# EasyEDA Pro project coildriver.eprj, schematic Schematic1
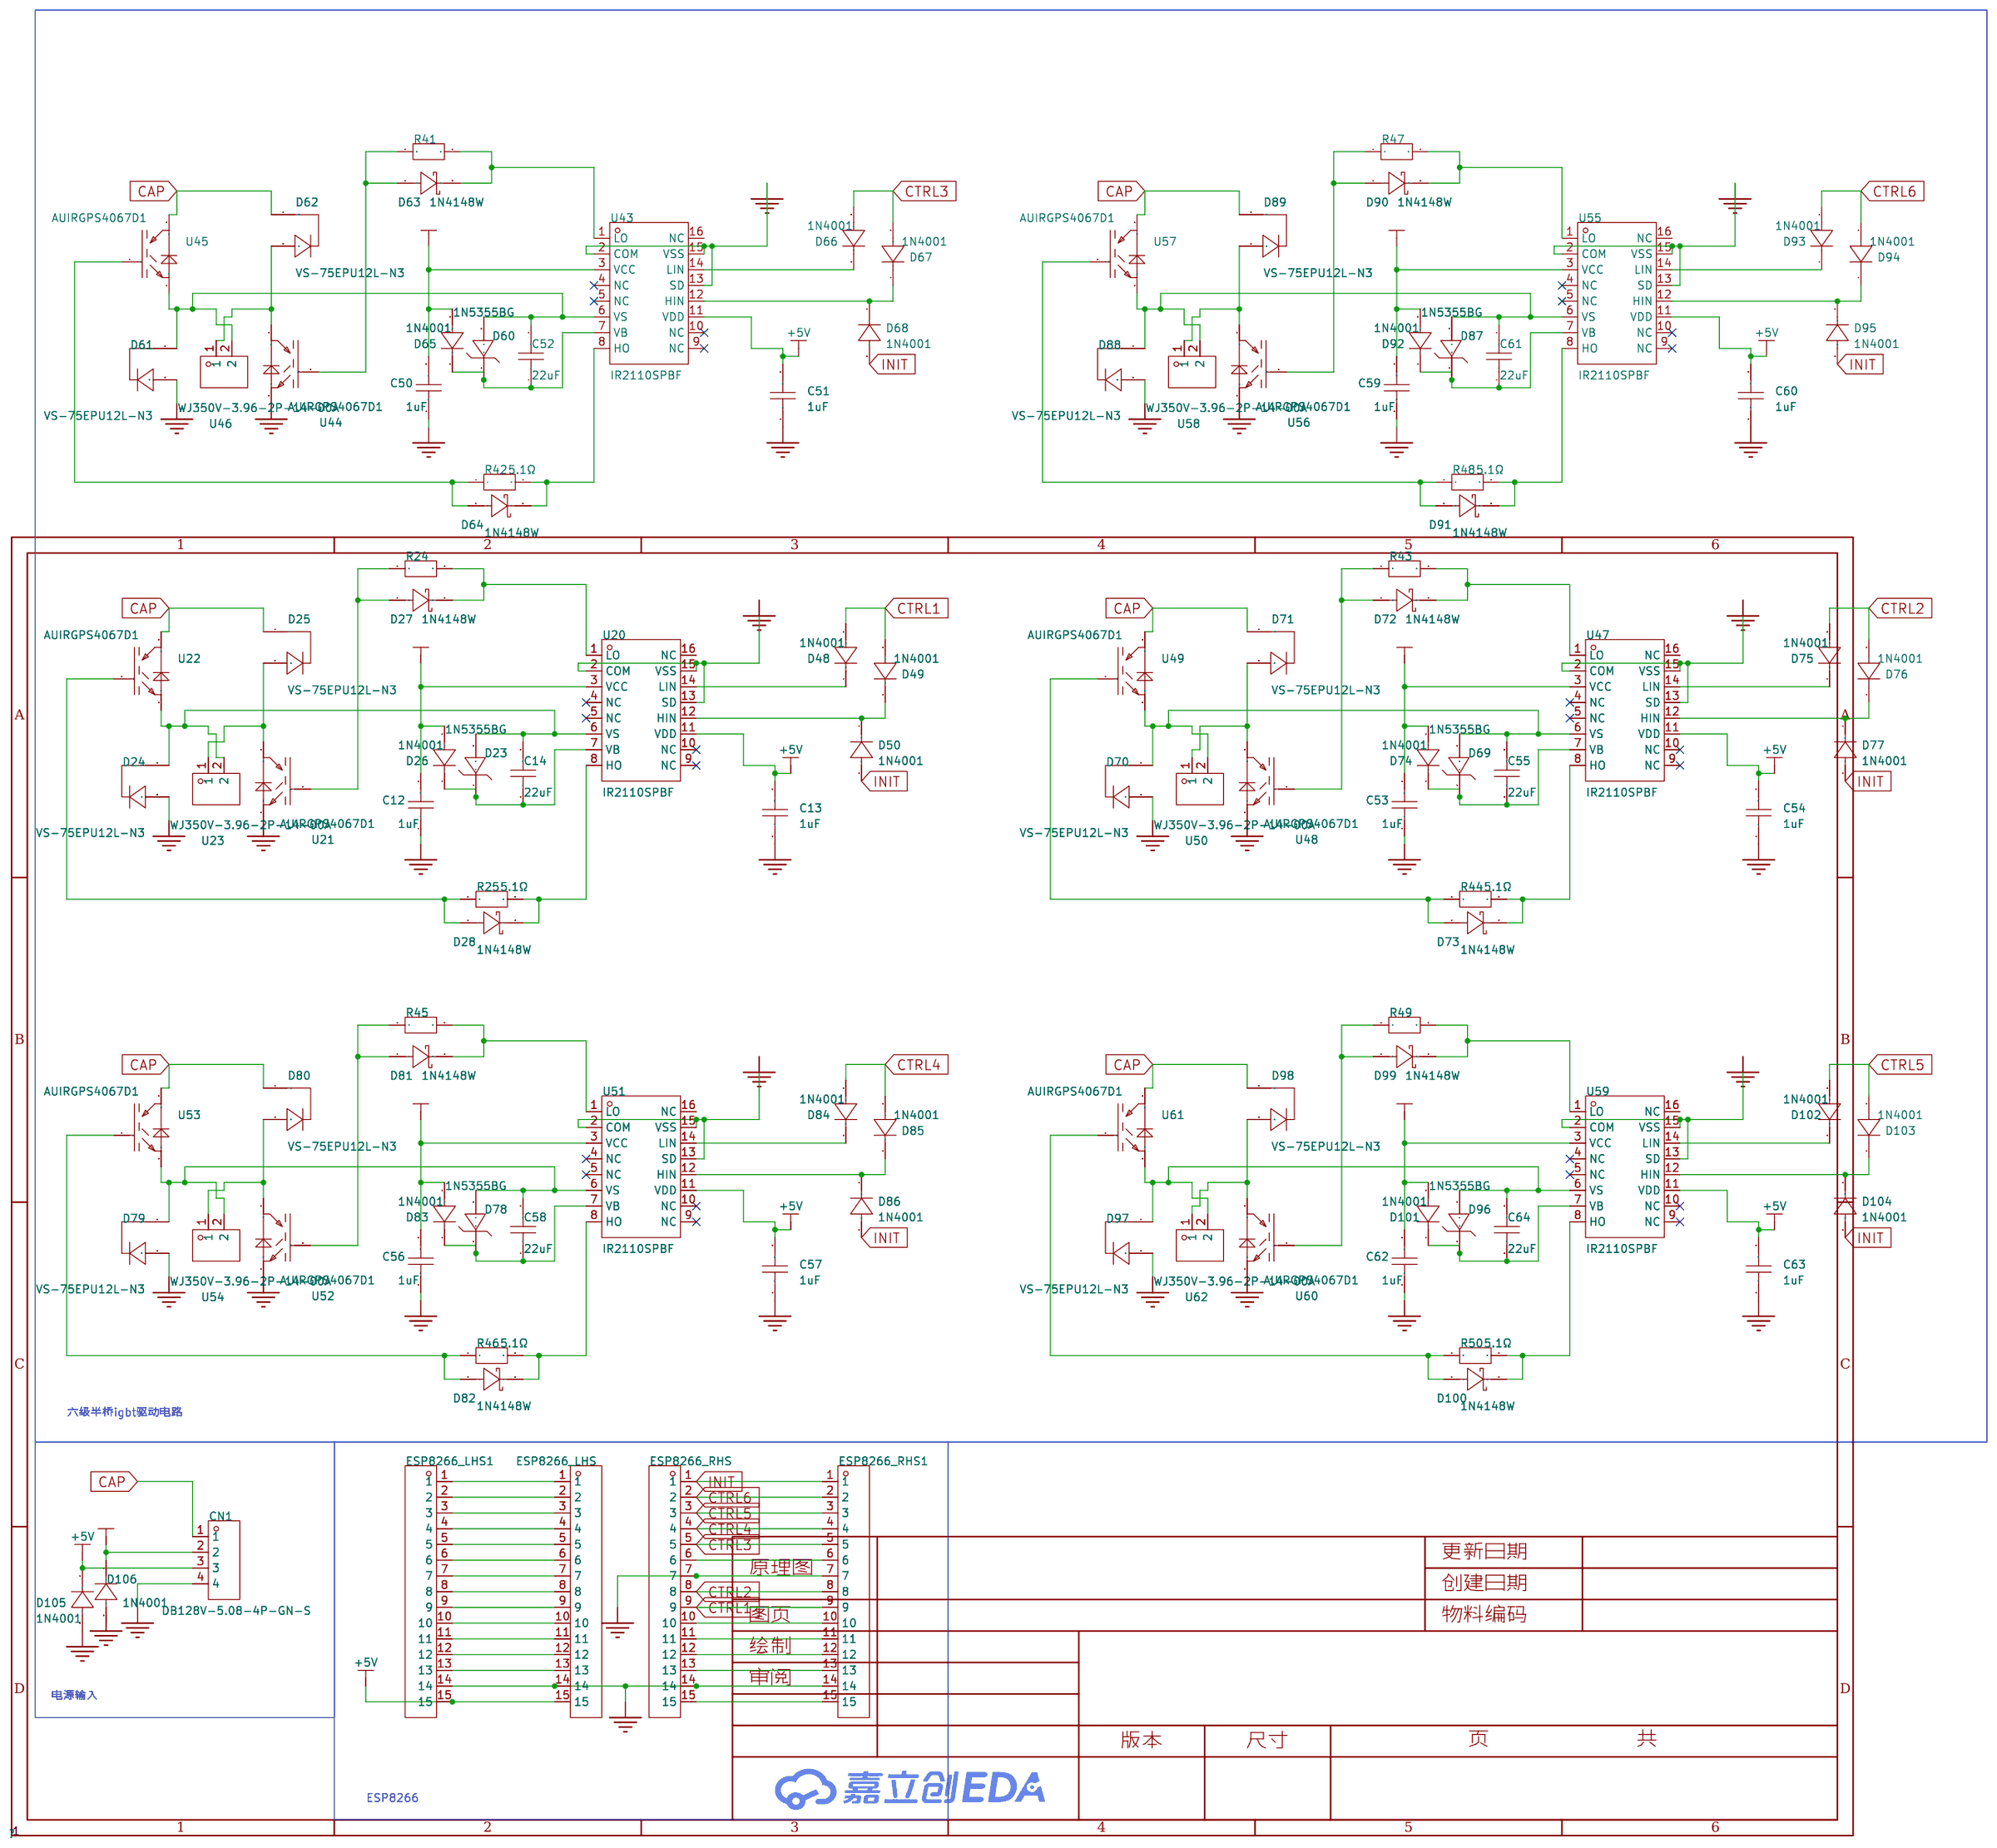
[diagram p0: schematic sheet]

## Parts
C12  1uF  [C0603]
C13  1uF  [C0603]
C14  22uF  [C0603]
C50  1uF  [C0603]
C51  1uF  [C0603]
C52  22uF  [C0603]
C53  1uF  [C0603]
C54  1uF  [C0603]
C55  22uF  [C0603]
C56  1uF  [C0603]
C57  1uF  [C0603]
C58  22uF  [C0603]
C59  1uF  [C0603]
C60  1uF  [C0603]
C61  22uF  [C0603]
C62  1uF  [C0603]
C63  1uF  [C0603]
C64  22uF  [C0603]
CN1  DB128V-5.08-4P-GN-S  [CONN-TH_4P-P5.08_DIBO_DB128V-5.08]
D23  1N5355BG  [DO-201_BD5.3-L9.5-P13.50-D1.4-RD]
D24  VS-75EPU12L-N3  [TO-247-2_L15.8-W5.0-P10.92-L]
D25  VS-75EPU12L-N3  [TO-247-2_L15.8-W5.0-P10.92-L]
D26  1N4001  [SMA_L4.3-W2.5-LS5.0-RD]
D27  1N4148W  [SOD-123_L2.7-W1.6-LS3.7-FD]
D28  1N4148W  [SOD-123_L2.7-W1.6-LS3.7-FD]
D48  1N4001  [SMA_L4.3-W2.5-LS5.0-RD]
D49  1N4001  [SMA_L4.3-W2.5-LS5.0-RD]
D50  1N4001  [SMA_L4.3-W2.5-LS5.0-RD]
D60  1N5355BG  [DO-201_BD5.3-L9.5-P13.50-D1.4-RD]
D61  VS-75EPU12L-N3  [TO-247-2_L15.8-W5.0-P10.92-L]
D62  VS-75EPU12L-N3  [TO-247-2_L15.8-W5.0-P10.92-L]
D63  1N4148W  [SOD-123_L2.7-W1.6-LS3.7-FD]
D64  1N4148W  [SOD-123_L2.7-W1.6-LS3.7-FD]
D65  1N4001  [SMA_L4.3-W2.5-LS5.0-RD]
D66  1N4001  [SMA_L4.3-W2.5-LS5.0-RD]
D67  1N4001  [SMA_L4.3-W2.5-LS5.0-RD]
D68  1N4001  [SMA_L4.3-W2.5-LS5.0-RD]
D69  1N5355BG  [DO-201_BD5.3-L9.5-P13.50-D1.4-RD]
D70  VS-75EPU12L-N3  [TO-247-2_L15.8-W5.0-P10.92-L]
D71  VS-75EPU12L-N3  [TO-247-2_L15.8-W5.0-P10.92-L]
D72  1N4148W  [SOD-123_L2.7-W1.6-LS3.7-FD]
D73  1N4148W  [SOD-123_L2.7-W1.6-LS3.7-FD]
D74  1N4001  [SMA_L4.3-W2.5-LS5.0-RD]
D75  1N4001  [SMA_L4.3-W2.5-LS5.0-RD]
D76  1N4001  [SMA_L4.3-W2.5-LS5.0-RD]
D77  1N4001  [SMA_L4.3-W2.5-LS5.0-RD]
D78  1N5355BG  [DO-201_BD5.3-L9.5-P13.50-D1.4-RD]
D79  VS-75EPU12L-N3  [TO-247-2_L15.8-W5.0-P10.92-L]
D80  VS-75EPU12L-N3  [TO-247-2_L15.8-W5.0-P10.92-L]
D81  1N4148W  [SOD-123_L2.7-W1.6-LS3.7-FD]
D82  1N4148W  [SOD-123_L2.7-W1.6-LS3.7-FD]
D83  1N4001  [SMA_L4.3-W2.5-LS5.0-RD]
D84  1N4001  [SMA_L4.3-W2.5-LS5.0-RD]
D85  1N4001  [SMA_L4.3-W2.5-LS5.0-RD]
D86  1N4001  [SMA_L4.3-W2.5-LS5.0-RD]
D87  1N5355BG  [DO-201_BD5.3-L9.5-P13.50-D1.4-RD]
D88  VS-75EPU12L-N3  [TO-247-2_L15.8-W5.0-P10.92-L]
D89  VS-75EPU12L-N3  [TO-247-2_L15.8-W5.0-P10.92-L]
D90  1N4148W  [SOD-123_L2.7-W1.6-LS3.7-FD]
D91  1N4148W  [SOD-123_L2.7-W1.6-LS3.7-FD]
D92  1N4001  [SMA_L4.3-W2.5-LS5.0-RD]
D93  1N4001  [SMA_L4.3-W2.5-LS5.0-RD]
D94  1N4001  [SMA_L4.3-W2.5-LS5.0-RD]
D95  1N4001  [SMA_L4.3-W2.5-LS5.0-RD]
D96  1N5355BG  [DO-201_BD5.3-L9.5-P13.50-D1.4-RD]
D97  VS-75EPU12L-N3  [TO-247-2_L15.8-W5.0-P10.92-L]
D98  VS-75EPU12L-N3  [TO-247-2_L15.8-W5.0-P10.92-L]
D99  1N4148W  [SOD-123_L2.7-W1.6-LS3.7-FD]
D100  1N4148W  [SOD-123_L2.7-W1.6-LS3.7-FD]
D101  1N4001  [SMA_L4.3-W2.5-LS5.0-RD]
D102  1N4001  [SMA_L4.3-W2.5-LS5.0-RD]
D103  1N4001  [SMA_L4.3-W2.5-LS5.0-RD]
D104  1N4001  [SMA_L4.3-W2.5-LS5.0-RD]
D105  1N4001  [SMA_L4.3-W2.5-LS5.0-RD]
D106  1N4001  [SMA_L4.3-W2.5-LS5.0-RD]
ESP8266_LHS  KH-2.54FH-1X15P-H8.5  [HDR-TH_15P-P2.54-V-F]
ESP8266_LHS1  KH-2.54FH-1X15P-H8.5  [HDR-TH_15P-P2.54-V-F]
ESP8266_RHS  KH-2.54FH-1X15P-H8.5  [HDR-TH_15P-P2.54-V-F]
ESP8266_RHS1  KH-2.54FH-1X15P-H8.5  [HDR-TH_15P-P2.54-V-F]
R24  5.1Ω  [R1206]
R25  5.1Ω  [R1206]
R41  5.1Ω  [R1206]
R42  5.1Ω  [R1206]
R43  5.1Ω  [R1206]
R44  5.1Ω  [R1206]
R45  5.1Ω  [R1206]
R46  5.1Ω  [R1206]
R47  5.1Ω  [R1206]
R48  5.1Ω  [R1206]
R49  5.1Ω  [R1206]
R50  5.1Ω  [R1206]
U20  IR2110SPBF  [SOIC-16_L10.3-W7.5-P1.27-LS10.3-BL]
U21  AUIRGPS4067D1  [SUPER-247_L15.6-W5.0-P5.45-L]
U22  AUIRGPS4067D1  [SUPER-247_L15.6-W5.0-P5.45-L]
U23  WJ350V-3.96-2P-14-00A  [CONN-TH_2P-P3.96_WJ350V-3.96-2P-14-00A]
U43  IR2110SPBF  [SOIC-16_L10.3-W7.5-P1.27-LS10.3-BL]
U44  AUIRGPS4067D1  [SUPER-247_L15.6-W5.0-P5.45-L]
U45  AUIRGPS4067D1  [SUPER-247_L15.6-W5.0-P5.45-L]
U46  WJ350V-3.96-2P-14-00A  [CONN-TH_2P-P3.96_WJ350V-3.96-2P-14-00A]
U47  IR2110SPBF  [SOIC-16_L10.3-W7.5-P1.27-LS10.3-BL]
U48  AUIRGPS4067D1  [SUPER-247_L15.6-W5.0-P5.45-L]
U49  AUIRGPS4067D1  [SUPER-247_L15.6-W5.0-P5.45-L]
U50  WJ350V-3.96-2P-14-00A  [CONN-TH_2P-P3.96_WJ350V-3.96-2P-14-00A]
U51  IR2110SPBF  [SOIC-16_L10.3-W7.5-P1.27-LS10.3-BL]
U52  AUIRGPS4067D1  [SUPER-247_L15.6-W5.0-P5.45-L]
U53  AUIRGPS4067D1  [SUPER-247_L15.6-W5.0-P5.45-L]
U54  WJ350V-3.96-2P-14-00A  [CONN-TH_2P-P3.96_WJ350V-3.96-2P-14-00A]
U55  IR2110SPBF  [SOIC-16_L10.3-W7.5-P1.27-LS10.3-BL]
U56  AUIRGPS4067D1  [SUPER-247_L15.6-W5.0-P5.45-L]
U57  AUIRGPS4067D1  [SUPER-247_L15.6-W5.0-P5.45-L]
U58  WJ350V-3.96-2P-14-00A  [CONN-TH_2P-P3.96_WJ350V-3.96-2P-14-00A]
U59  IR2110SPBF  [SOIC-16_L10.3-W7.5-P1.27-LS10.3-BL]
U60  AUIRGPS4067D1  [SUPER-247_L15.6-W5.0-P5.45-L]
U61  AUIRGPS4067D1  [SUPER-247_L15.6-W5.0-P5.45-L]
U62  WJ350V-3.96-2P-14-00A  [CONN-TH_2P-P3.96_WJ350V-3.96-2P-14-00A]

## Library data of the parts
C12 C13 C50 C51 C53 C54 C56 C57 C59 C60 C62 C63 = CL10A105KB8NNNC: LCSC Part Name: 1uF ±10% 50V; Supplier Part: C15849; Manufacturer: SAMSUNG(三星); Supplier Footprint: 0603; JLCPCB Part Class: Basic Part; Datasheet: https://atta.szlcsc.com/upload/public/pdf/source/20160218/1457707763339.pdf; Supplier: LCSC; Tolerance: ±10%; Voltage Rated: 50V; Temperature Coefficient: X5R
C14 C52 C55 C58 C61 C64 = CL10A226MQ8NRNC: LCSC Part Name: 22uF ±20% 6.3V; Supplier Part: C59461; Manufacturer: SAMSUNG(三星); Supplier Footprint: 0603; JLCPCB Part Class: Basic Part; Datasheet: https://atta.szlcsc.com/upload/public/pdf/source/20160218/1457707763339.pdf; Supplier: LCSC; Tolerance: ±20%; Voltage Rated: 6.3V; Temperature Coefficient: X5R
CN1 = DB128V-5.08-4P-GN-S: LCSC Part Name: 5.08mm 1x4P 排数:1 每排P数:4 直插; Supplier Part: C2915641; Manufacturer: DORABO(地博电气); Supplier Footprint: 插件,P=5.08mm; JLCPCB Part Class: 扩展库; Datasheet: https://atta.szlcsc.com/upload/public/pdf/source/20230106/CC449C10514519CDCE20F1C37DBF2DAC.pdf; Supplier: LCSC; Structure: 1x4P; Pitch: 5.08mm; Color: 绿色; Mounting Style: 直插; Current Rating (Max): 20A; Voltage Rating (Max): 300V; Number of Pins: 4P; Number of Rows: 1; Wire Gauge - AWG: 12~30; Wire Gauge - mm2: 2.5; Number of PINs Per Row: 4; Operating Temperature Range: -40℃~+105℃
D23 D60 D69 D78 D87 D96 = 1N5355BG: Supplier Part: C232448; Manufacturer: onsemi(安森美); Supplier Footprint: DO-201; JLCPCB Part Class: 扩展库; Datasheet: https://atta.szlcsc.com/upload/public/pdf/source/20221020/A8BE51F363EA53205BAD311FF4A36ACF.pdf; Supplier: LCSC; Diode Configuration: 独立式; Zener Voltage (Nom): 18V; Reverse Leakage Current (Ir): 500nA@13.7V; Zener Voltage (Range): 17.1V~18.9V; Power Dissipation: 5W; Zener Impedance (Zzt): 2.5Ω; Tolerance: ±5%
D24 D25 D61 D62 D70 D71 D79 D80 D88 D89 D97 D98 = VS-75EPU12L-N3: LCSC Part Name: 电压:1.2kV 电流:75A; Supplier Part: C335787; Manufacturer: VISHAY(威世); Supplier Footprint: TO-247-2; JLCPCB Part Class: 扩展库; Datasheet: https://atta.szlcsc.com/upload/public/pdf/source/20181127/C335787_ECD477527F5F67B2867CBD5AAE4D0851.pdf; Supplier: LCSC; Diode Configuration: 独立式; Forward Voltage (Vf@If): 2.05V@75A; Reverse Voltage (Vr): 1.2kV; Average Rectified Current (Io): 75A; Reverse Leakage Current: 420uA@1.2kV
D26 D48-D50 D65-D68 D74-D77 D83-D86 D92-D95 D101-D106 = 1N4001_C727079: LCSC Part Name: 电压:50V 电流:1A; Supplier Part: C727079; Manufacturer: TWGMC(台湾迪嘉); Supplier Footprint: SMA(DO-214AC); JLCPCB Part Class: 扩展库; Datasheet: https://atta.szlcsc.com/upload/public/pdf/source/20200828/C727079_3A05254382567072883400655AE0ED46.pdf; Supplier: LCSC; Diode Configuration: 独立式; Forward Voltage (Vf@If): 1.1V@1A; Reverse Voltage (Vr): 50V; Average Rectified Current (Io): 1A; Reverse Leakage Current: 5uA@50V
D27 D28 D63 D64 D72 D73 D81 D82 D90 D91 D99 D100 = 1N4148W_C7420318: LCSC Part Name: 电压:100V 电流:150mA; Supplier Part: C7420318; Manufacturer: 宏迦橙; Supplier Footprint: SOD-123; JLCPCB Part Class: 扩展库; Datasheet: https://atta.szlcsc.com/upload/public/pdf/source/20230828/E5C3F7A4272052930A7E03B75759BF50.pdf; Supplier: LCSC; Diode Configuration: 独立式; Forward Voltage (Vf@If): 1.25V@150mA; Reverse Voltage (Vr): 100V; Average Rectified Current (Io): 150mA; Power Dissipation: 400mW; Reverse Leakage Current: 1uA@75V; Reverse Recovery Time (trr): 4ns; Operating Temperature: -55℃~+150℃
ESP8266_LHS ESP8266_LHS1 ESP8266_RHS ESP8266_RHS1 = KH-2.54FH-1X15P-H8.5: LCSC Part Name: 间距:2.54mm 1x15P 直插; Supplier Part: C2932676; Manufacturer: kinghelm(金航标); Supplier Footprint: 插件,P=2.54mm; JLCPCB Part Class: 扩展库; Datasheet: https://atta.szlcsc.com/upload/public/pdf/source/20211220/977AA415CFA981E866620A80068F25CA.pdf; Supplier: LCSC; Holes Structure: 1x15P; Pitch: 2.54mm; Circular Hole / Square Hole: 方孔; Mounting Type: 直插; Number of Rows: 单排; Number of Holes: 15P; Current Rating (Max): 3A; Holes Direction: 顶部; Insulation Height: 8.5mm; Operating Temperature Range: -40℃~+105℃
R24 R25 R41-R50 = FRC1206F5R10TS: LCSC Part Name: 5.1Ω ±1% 250mW 厚膜电阻; Supplier Part: C2933736; Manufacturer: FOJAN(富捷); Supplier Footprint: 1206; JLCPCB Part Class: 扩展库; Datasheet: https://atta.szlcsc.com/upload/public/pdf/source/20211221/925EC7D7225764EE0046F22065062C87.pdf; Supplier: LCSC; Type: 厚膜电阻; Tolerance: ±1%; Power(Watts): 250mW; Overload Voltage (Max): 200V; Temperature Coefficient: ±200ppm/℃; Operating Temperature Range: -55℃~+155℃
U20 U43 U47 U51 U55 U59 = IR2110SPBF: Supplier Part: C537554; Manufacturer: Infineon(英飞凌); Supplier Footprint: SOIC-16-300mil; JLCPCB Part Class: 扩展库; Datasheet: https://atta.szlcsc.com/upload/public/pdf/source/20200525/C537554_DAB217F314E1627DF0DDC7BBE3BE6BA1.pdf; Supplier: LCSC; Driven Configuration: 半桥; Load Type: MOSFET；IGBT; Number of Drivers: 2; Peak Output Current(sink): 2A; Peak Output Current(source): 2A; Supply Voltage: 3.3V~20V; Rise Time: 25ns; Fall Time: 17ns; Operating Temperature: -40℃~+150℃@(Tj)
U21 U22 U44 U45 U48 U49 U52 U53 U56 U57 U60 U61 = AUIRGPS4067D1: Supplier Part: C9900044144; Supplier Footprint: Super-247; Supplier: LCSC
U23 U46 U50 U54 U58 U62 = WJ350V-3.96-2P-14-00A: LCSC Part Name: 接线端子 直插式/3.96mm 2P 绿色 绿色; Supplier Part: C3031444; Manufacturer: KANGNEX(康奈克斯电气); Supplier Footprint: P=3.96mm; JLCPCB Part Class: 扩展库; Datasheet: https://atta.szlcsc.com/upload/public/pdf/source/20220629/BAC37F157A480165C1624CF249DBB00A.pdf; Supplier: LCSC

## Nets
12V: C12.2 C50.2 C53.2 C56.2 C59.2 C62.2 CN1.2 D26.2(A) D65.2(A) D74.2(A) D83.2(A) D92.2(A) D101.2(A) D106.1(K) U20.3(VCC) U43.3(VCC) U47.3(VCC) U51.3(VCC) U55.3(VCC) U59.3(VCC)
+5V: C13.2 C51.2 C54.2 C57.2 C60.2 C63.2 CN1.3 D105.1(K) ESP8266_LHS.15 ESP8266_LHS1.15 U20.11(VDD) U43.11(VDD) U47.11(VDD) U51.11(VDD) U55.11(VDD) U59.11(VDD)
GND: C12.1 C13.1 C50.1 C51.1 C53.1 C54.1 C56.1 C57.1 C59.1 C60.1 C62.1 C63.1 CN1.4 D24.3 D61.3 D70.3 D79.3 D88.3 D97.3 D105.2(A) D106.2(A) ESP8266_LHS.14 ESP8266_LHS1.14 ESP8266_RHS.7 ESP8266_RHS.14 ESP8266_RHS1.7 ESP8266_RHS1.14 U20.2(COM) U20.13(SD) U20.15(VSS) U21.3(E) U43.2(COM) U43.13(SD) U43.15(VSS) U44.3(E) U47.2(COM) U47.13(SD) U47.15(VSS) U48.3(E) U51.2(COM) U51.13(SD) U51.15(VSS) U52.3(E) U55.2(COM) U55.13(SD) U55.15(VSS) U56.3(E) U59.2(COM) U59.13(SD) U59.15(VSS) U60.3(E)
CAP: CN1.1 D25.1 D62.1 D71.1 D80.1 D89.1 D98.1 U22.2(C) U45.2(C) U49.2(C) U53.2(C) U57.2(C) U61.2(C)
CTRL1: D48.2(A) D49.2(A) ESP8266_RHS.9 ESP8266_RHS1.9
CTRL2: D75.2(A) D76.2(A) ESP8266_RHS.8 ESP8266_RHS1.8
CTRL3: D66.2(A) D67.2(A) ESP8266_RHS.5 ESP8266_RHS1.5
CTRL4: D84.2(A) D85.2(A) ESP8266_RHS.4 ESP8266_RHS1.4
CTRL5: D102.2(A) D103.2(A) ESP8266_RHS.3 ESP8266_RHS1.3
CTRL6: D93.2(A) D94.2(A) ESP8266_RHS.2 ESP8266_RHS1.2
INIT: D50.2(A) D68.2(A) D77.2(A) D86.2(A) D95.2(A) D104.2(A) ESP8266_RHS.1 ESP8266_RHS1.1
$1N13206: D25.3 U21.2(C) U23.1
$1N13207: D48.1(K) U20.14(LIN)
$1N13208: D49.1(K) D50.1(K) U20.12(HIN)
$1N13209: D28.2(K) R25.2 U20.8(HO)
$1N13210: D28.1(A) R25.1 U22.1(G)
$1N13211: D27.2(K) R24.2 U20.1(LO)
$1N13212: D27.1(A) R24.1 U21.1(G)
$1N30415: C14.2 D23.2(A) D24.1 U20.6(VS) U22.3(E) U23.2
$1N30437: C14.1 D23.1(K) D26.1(K) U20.7(VB)
$1N32363: D64.2(K) R42.2 U43.8(HO)
$1N32364: C52.1 D60.1(K) D65.1(K) U43.7(VB)
$1N32374: C52.2 D60.2(A) D61.1 U43.6(VS) U45.3(E) U46.2
$1N32395: D66.1(K) U43.14(LIN)
$1N32396: D67.1(K) D68.1(K) U43.12(HIN)
$1N32406: D63.2(K) R41.2 U43.1(LO)
$1N32408: D63.1(A) R41.1 U44.1(G)
$1N32409: D62.3 U44.2(C) U46.1
$1N32412: D64.1(A) R42.1 U45.1(G)
$1N33221: D73.2(K) R44.2 U47.8(HO)
$1N33222: C55.1 D69.1(K) D74.1(K) U47.7(VB)
$1N33232: C55.2 D69.2(A) D70.1 U47.6(VS) U49.3(E) U50.2
$1N33253: D75.1(K) U47.14(LIN)
$1N33254: D76.1(K) D77.1(K) U47.12(HIN)
$1N33264: D72.2(K) R43.2 U47.1(LO)
$1N33266: D72.1(A) R43.1 U48.1(G)
$1N33267: D71.3 U48.2(C) U50.1
$1N33270: D73.1(A) R44.1 U49.1(G)
$1N36530: D80.3 U52.2(C) U54.1
$1N36531: D84.1(K) U51.14(LIN)
$1N36532: D85.1(K) D86.1(K) U51.12(HIN)
$1N36535: D82.2(K) R46.2 U51.8(HO)
$1N36536: D82.1(A) R46.1 U53.1(G)
$1N36537: D81.2(K) R45.2 U51.1(LO)
$1N36538: D81.1(A) R45.1 U52.1(G)
$1N36559: C58.1 D78.1(K) D83.1(K) U51.7(VB)
$1N36580: D89.3 U56.2(C) U58.1
$1N36581: D93.1(K) U55.14(LIN)
$1N36582: D94.1(K) D95.1(K) U55.12(HIN)
$1N36585: D91.2(K) R48.2 U55.8(HO)
$1N36586: D91.1(A) R48.1 U57.1(G)
$1N36587: D90.2(K) R47.2 U55.1(LO)
$1N36588: D90.1(A) R47.1 U56.1(G)
$1N36595: C61.2 D87.2(A) D88.1 U55.6(VS) U57.3(E) U58.2
$1N36609: C61.1 D87.1(K) D92.1(K) U55.7(VB)
$1N36630: D98.3 U60.2(C) U62.1
$1N36631: D102.1(K) U59.14(LIN)
$1N36632: D103.1(K) D104.1(K) U59.12(HIN)
$1N36635: D100.2(K) R50.2 U59.8(HO)
$1N36636: D100.1(A) R50.1 U61.1(G)
$1N36637: D99.2(K) R49.2 U59.1(LO)
$1N36638: D99.1(A) R49.1 U60.1(G)
$1N36645: C64.2 D96.2(A) D97.1 U59.6(VS) U61.3(E) U62.2
$1N36659: C64.1 D96.1(K) D101.1(K) U59.7(VB)
$1N37726: ESP8266_RHS.6 ESP8266_RHS1.6
$1N37760: ESP8266_RHS.10 ESP8266_RHS1.10
$1N37765: ESP8266_RHS.11 ESP8266_RHS1.11
$1N37770: ESP8266_RHS.12 ESP8266_RHS1.12
$1N37775: ESP8266_RHS.13 ESP8266_RHS1.13
$1N37785: ESP8266_RHS.15 ESP8266_RHS1.15
$1N37872: ESP8266_LHS.1 ESP8266_LHS1.1
$1N37876: ESP8266_LHS.2 ESP8266_LHS1.2
$1N37881: ESP8266_LHS.3 ESP8266_LHS1.3
$1N37886: ESP8266_LHS.4 ESP8266_LHS1.4
$1N37891: ESP8266_LHS.5 ESP8266_LHS1.5
$1N37903: ESP8266_LHS.6 ESP8266_LHS1.6
$1N37907: ESP8266_LHS.7 ESP8266_LHS1.7
$1N37912: ESP8266_LHS.8 ESP8266_LHS1.8
$1N37917: ESP8266_LHS.9 ESP8266_LHS1.9
$1N37922: ESP8266_LHS.10 ESP8266_LHS1.10
$1N37927: ESP8266_LHS.11 ESP8266_LHS1.11
$1N37932: ESP8266_LHS.12 ESP8266_LHS1.12
$1N37937: ESP8266_LHS.13 ESP8266_LHS1.13
$1N38352: C58.2 D78.2(A) D79.1 U51.6(VS) U53.3(E) U54.2

Not connected (* = marked no-connect by the designer): U20 4(NC)* 5(NC)* 9(NC)* 10(NC)* 16(NC); U43 4(NC)* 5(NC)* 9(NC)* 10(NC)* 16(NC); U47 4(NC)* 5(NC)* 9(NC)* 10(NC)* 16(NC); U51 4(NC)* 5(NC)* 9(NC)* 10(NC)* 16(NC); U55 4(NC)* 5(NC)* 9(NC)* 10(NC)* 16(NC); U59 4(NC)* 5(NC)* 9(NC)* 10(NC)* 16(NC)

## Notes on the sheet
- 六级半桥igbt驱动电路
- 电源输入
- ESP8266
